# Altium schematic sheet 2_MCU-BLE.SchDoc
size B; SheetNumber: 3; SheetTotal: 13
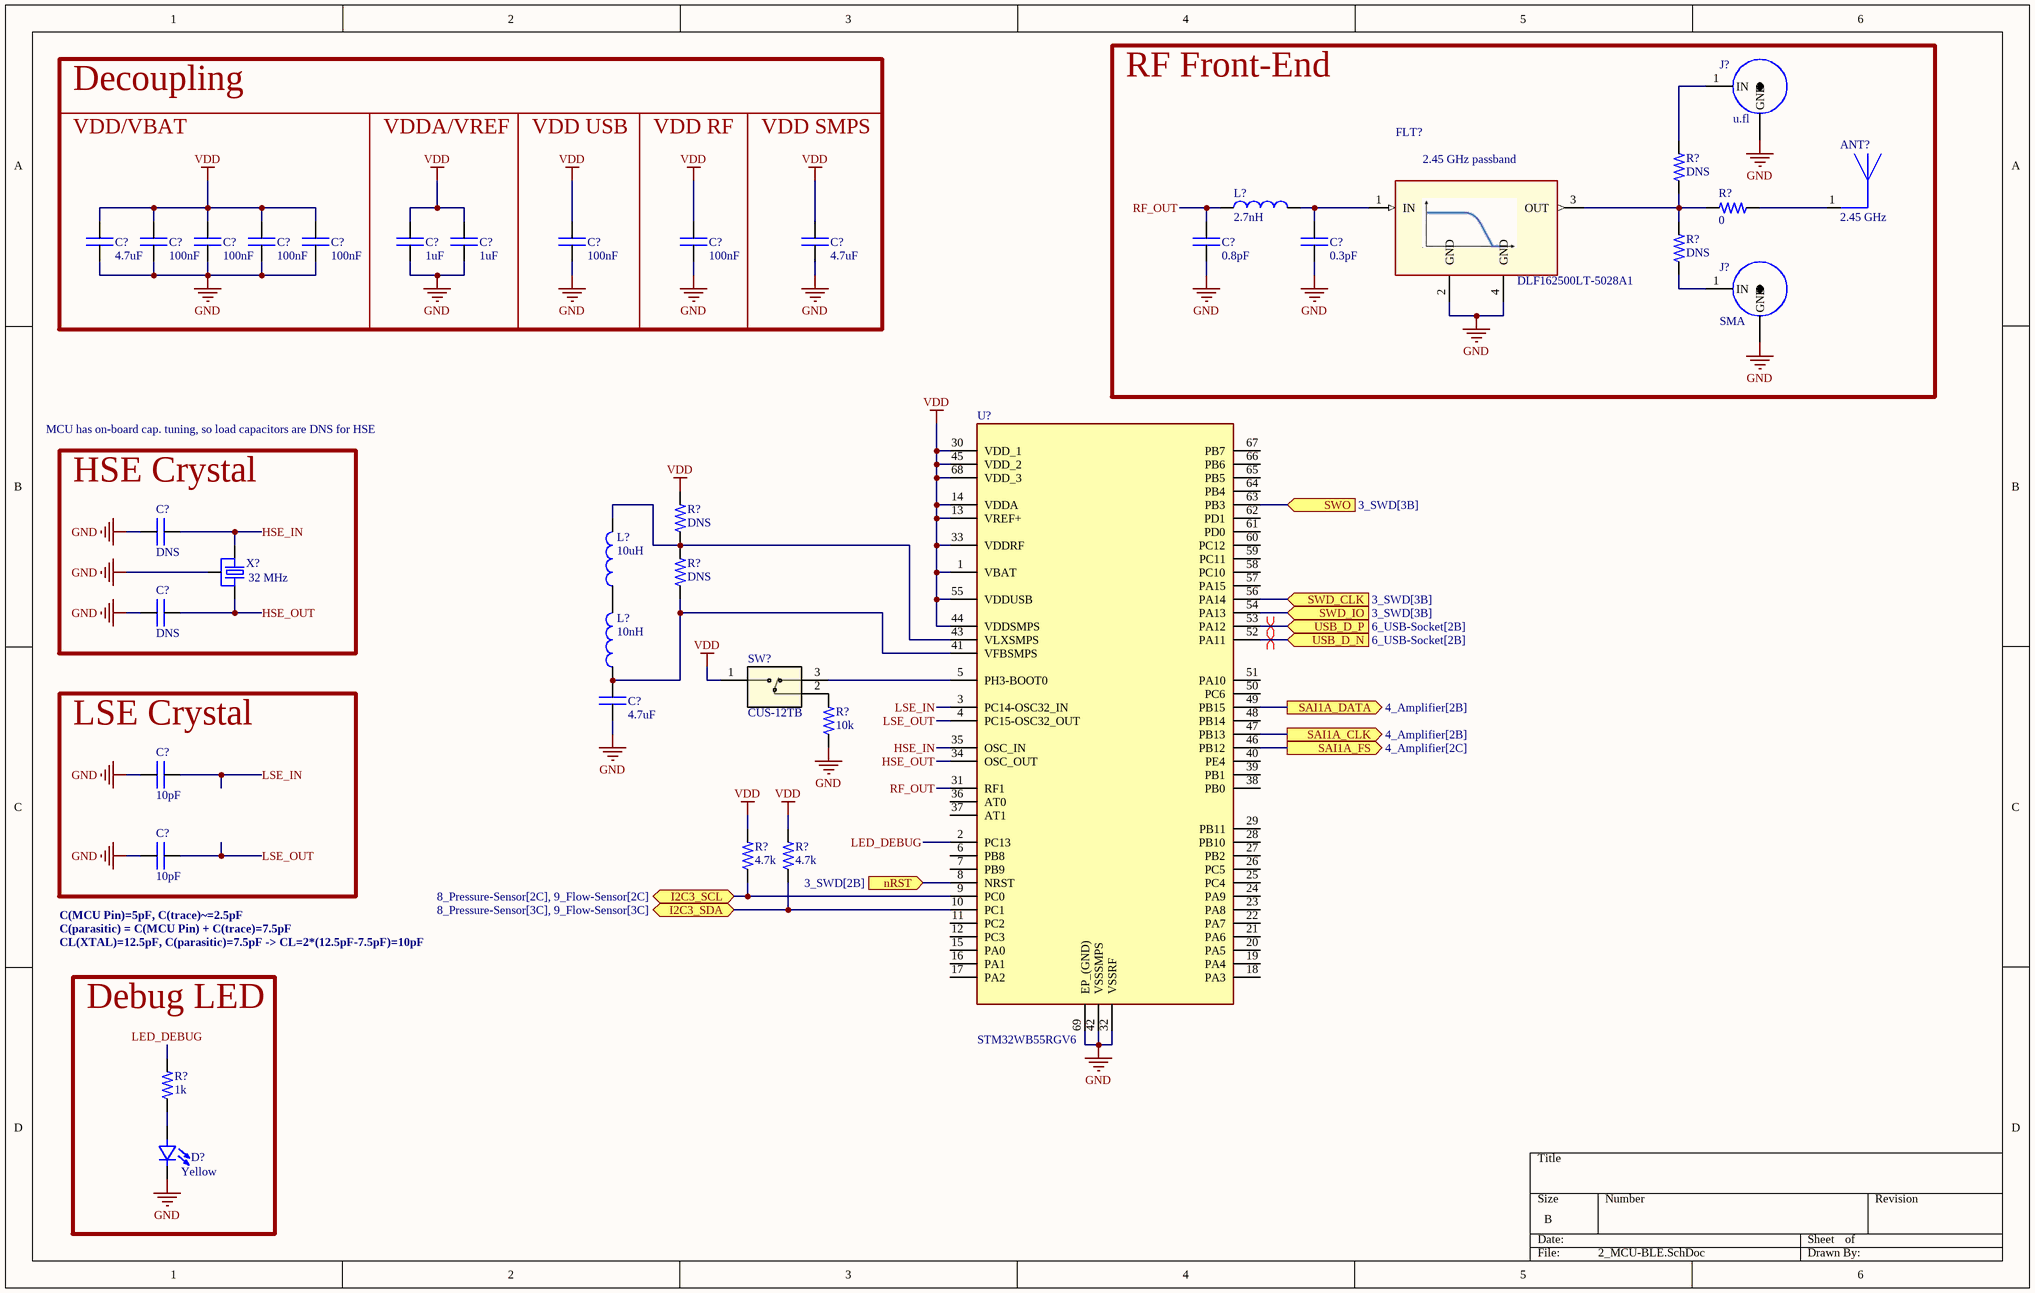
[diagram p0: 2_MCU-BLE.SchDoc]

## Parts
(Parts that share a designator on the sheet are numbered #1, #2 ... from top to bottom, then left to right.)
ANT?  Center Frequency: 2.45 GHz  [ANTC5220X130N]  (hidden comment: CHIP ANTENNA)
C?#1  value 4.7uF  [0402C]  (hidden comment: CAP)
C?#2  value 100nF  [0402C]  (hidden comment: CAP)
C?#3  value 100nF  [0402C]  (hidden comment: CAP)
C?#4  value 100nF  [0402C]  (hidden comment: CAP)
C?#5  value 100nF  [0402C]  (hidden comment: CAP)
C?#6  value 1uF  [0402C]  (hidden comment: CAP)
C?#7  value 1uF  [0402C]  (hidden comment: CAP)
C?#8  value 100nF  [0402C]  (hidden comment: CAP)
C?#9  value 100nF  [0402C]  (hidden comment: CAP)
C?#10  value 4.7uF  [0402C]  (hidden comment: CAP)
C?#11  value 0.8pF  [0402C]  (hidden comment: CAP)
C?#12  value 0.3pF  [0402C]  (hidden comment: CAP)
C?#13  value DNS  [0402C]  (hidden comment: CAP)
C?#14  value DNS  [0402C]  (hidden comment: CAP)
C?#15  value 4.7uF  [0402C]  (hidden comment: CAP)
C?#16  value 10pF  [0402C]  (hidden comment: CAP)
C?#17  value 10pF  [0402C]  (hidden comment: CAP)
D?  Color: Yellow  [0603-LED]  (hidden comment: LED - single)
FLT?  DLF162500LT-5028A1  [DLF-4_1P6X0P8]
J?#1  u.fl  [U.FL]
J?#2  SMA  [SMA TH RA]
L?#1  value 2.7nH  [0806L]  (hidden comment: IND)
L?#2  value 10uH  (hidden comment: IND)
L?#3  value 10nH  (hidden comment: IND)
R?#1  value DNS  [0402R]  (hidden comment: RES)
R?#2  value 0  [0402R]  (hidden comment: RES)
R?#3  value DNS  [0402R]  (hidden comment: RES)
R?#4  value DNS  [0402R]  (hidden comment: RES)
R?#5  value DNS  [0402R]  (hidden comment: RES)
R?#6  value 10k  [0402R]  (hidden comment: RES)
R?#7  value 4.7k  [0402R]  (hidden comment: RES)
R?#8  value 4.7k  [0402R]  (hidden comment: RES)
R?#9  value 1k  [0402R]  (hidden comment: RES)
SW?  CUS-12TB  [CUS-12TB_NDC]
U?  STM32WB55RGV6  [VQFN-68]
X?  Frequency: 32 MHz  [32MHZ_SMD1612-4P]  (hidden comment: XTAL-OSC_32MHz)

## Blocks framed on the sheet
RF Front-End: ANT? C?#11 C?#12 FLT? J?#1 J?#2 L?#1 R?#1-R?#3
Decoupling: C?#1-C?#5
VDDA/VREF: C?#6 C?#7
VDD USB: C?#8
VDD RF: C?#9
VDD SMPS: C?#10
HSE Crystal: C?#13 C?#14 X?
LSE Crystal: C?#16 C?#17
Debug LED: D? R?#9

## Ports
I2C3_SCL (bidir, see 8_Pressure-Sensor[2C], 9_Flow-Sensor[2C]), I2C3_SDA (bidir, see 8_Pressure-Sensor[3C], 9_Flow-Sensor[3C]), nRST (in, see 3_SWD[2B]), SAI1A_CLK (out, see 4_Amplifier[2B]), SAI1A_DATA (out, see 4_Amplifier[2B]), SAI1A_FS (out, see 4_Amplifier[2C]), SWD_CLK (in, see 3_SWD[3B]), SWD_IO (in, see 3_SWD[3B]), SWO (in, see 3_SWD[3B]), USB_D_N (in, see 6_USB-Socket[2B]), USB_D_P (in, see 6_USB-Socket[2B])

## Nets
GND: C?#1.1 C?#2.1 C?#3.1 C?#4.1 C?#5.1 C?#6.1 C?#7.1 C?#8.1 C?#9.1 C?#10.1 C?#11.1 C?#12.1 C?#13.2 C?#14.2 C?#15.1 C?#16.2 C?#17.2 D?.2(C) FLT?.2(GND) FLT?.4(GND) J?#1.GND J?#2.GND R?#6.1 U?.32(VSSRF) U?.42(VSSSMPS) U?.69(EP_(GND)) X?.GND
VDD: C?#1.2 C?#2.2 C?#3.2 C?#4.2 C?#5.2 C?#6.2 C?#7.2 C?#8.2 C?#9.2 C?#10.2 R?#4.2 R?#7.2 R?#8.2 SW?.1 U?.1(VBAT) U?.13(VREF+) U?.14(VDDA) U?.30(VDD_1) U?.33(VDDRF) U?.44(VDDSMPS) U?.45(VDD_2) U?.55(VDDUSB) U?.68(VDD_3)
HSE_IN: C?#13.1 U?.35(OSC_IN) X?.1
HSE_OUT: C?#14.1 U?.34(OSC_OUT) X?.3
I2C3_SCL: R?#7.1 U?.9(PC0) ; port I2C3_SCL
I2C3_SDA: R?#8.1 U?.10(PC1) ; port I2C3_SDA
LED_DEBUG: R?#9.2 U?.2(PC13)
LSE_IN: C?#16.1 U?.3(PC14-OSC32_IN)
LSE_OUT: C?#17.1 U?.4(PC15-OSC32_OUT)
nRST: U?.8(NRST) ; port nRST
RF_OUT: C?#11.2 L?#1.1 U?.31(RF1)
SAI1A_CLK: U?.47(PB13) ; port SAI1A_CLK
SAI1A_DATA: U?.49(PB15) ; port SAI1A_DATA
SAI1A_FS: U?.46(PB12) ; port SAI1A_FS
SWD_CLK: U?.56(PA14) ; port SWD_CLK
SWD_IO: U?.54(PA13) ; port SWD_IO
SWO: U?.63(PB3) ; port SWO
USB_D_N: U?.52(PA11) ; port USB_D_N
USB_D_P: U?.53(PA12) ; port USB_D_P
NetANT?_1: ANT?.1 R?#2.1
NetC?#12_2: C?#12.2 FLT?.1(IN) L?#1.2
NetC?#15_2: C?#15.2 L?#3.1 R?#5.1 U?.41(VFBSMPS)
NetD?_1: D?.1(A) R?#9.1
NetFLT?_3: FLT?.3(OUT) R?#1.1 R?#2.2 R?#3.2
NetJ?#1_1: J?#1.1(IN) R?#1.2
NetJ?#2_1: J?#2.1(IN) R?#3.1
NetL?#2_1: L?#2.1 L?#3.2
NetL?#2_2: L?#2.2 R?#4.1 R?#5.2 U?.43(VLXSMPS)
NetR?#6_2: R?#6.2 SW?.2
NetSW?_3: SW?.3 U?.5(PH3-BOOT0)

Not connected (* = marked no-connect by the designer): U? 6(PB8) 7(PB9) 11(PC2) 12(PC3) 15(PA0) 16(PA1) 17(PA2) 18(PA3) 19(PA4) 20(PA5) 21(PA6) 22(PA7) 23(PA8) 24(PA9) 25(PC4) 26(PC5) 27(PB2) 28(PB10) 29(PB11) 36(AT0) 37(AT1) 38(PB0) 39(PB1) 40(PE4) 48(PB14) 50(PC6) 51(PA10) 57(PA15) 58(PC10) 59(PC11) 60(PC12) 61(PD0) 62(PD1) 64(PB4) 65(PB5) 66(PB6) 67(PB7)

## Layout directives
differential pair: USB_D_N, USB_D_P

## Notes on the sheet
- VDD/VBAT
- MCU has on-board cap. tuning, so load capacitors are DNS for HSE
- CL(XTAL)=12.5pF, C(parasitic)=7.5pF -> CL=2*(12.5pF-7.5pF)=10pF
- C(MCU Pin)=5pF, C(trace)~=2.5pF
- C(parasitic) = C(MCU Pin) + C(trace)=7.5pF
- (in symbol 2.45GHz LPF) 2.45 GHz passband

## Library data of the parts
ANT? = CHIP ANTENNA: MFR: microgate; MFR PN: MGMA5220H2450-A04MGMA5220H2450-A04; Value: MGMA5220H2450-A04; JLCPCB PN: C486321
C?#1-C?#10 C?#13-C?#15 = CAP: Capaicitor; MFR: *; MFR PN: *
C?#11 C?#12 = CAP: Capacitor; MFR: *; MFR PN: *; Footprint: *
  C?#11: JLCPCB PN: C387965
  C?#12: JLCPCB PN: C1855147
C?#16 C?#17 = CAP: Capaicitor; MFR PN: FN15N100J500PNG; MFR: *; JLCPCB PN: C328913
D? = LED - single: LED; Value: 19-213/Y2C-CQ2R2L/3T(CY); MFR: *; MFR PN: *; JLCPCB PN: C72038
FLT? = 2.45GHz LPF: RF FILTER LOW PASS 2.45GHZ 0603; MFR: TDK; MFR PN: DLF162500LT-5028A1; Value: DLF162500LT-5028A1; JLCPCB PN: C531364
J?#1 = u.fl CONN: u.fl 50Ohm; MFR: HRS(Hirose); MFR PN: U.FL-R-SMT-1(80); Value: U.FL-R-SMT-1(80); JLCPCB PN: C88374
J?#2 = SMA: SMA 50Ohm; MFR: DreamLNK; MFR PN: SMA-KWE901; Value: SMA-KWE901; JLCPCB PN: C914553
L?#1-L?#3 = IND: INDUCTOR; Footprint: *
  L?#1: JLCPCB PN: C963981
  L?#2 L?#3: JLCPCB PN: *
R?#1-R?#9 = RES: Resistor; MFR PN: *; MFR: *
  R?#1-R?#3 R?#7 R?#8: JLCPCB PN: *
  R?#4-R?#6 R?#9: Type: SMD
SW? = SPDT SLIDE SWITCH: JLC Alternate: / SSSS811101; MFR: Nidec Copal Electronics; MFR PN: CUS-12TB; Type: SMD
U? = STM32WB55RGV6: ARM Microcontrollers - MCU Ultra-low-power dual core Arm Cortex-M4 MCU 64 MHz, Cortex-M0 32MHz with 1 Mbyte Flash, BLE, 802.15.4, USB, LCD, AES-256; MFR: STMicroelectronics; Value: STM32WB55RGV6; JLCPCB Part #: *
X? = XTAL-OSC_32MHz: SMD Tuning Fork Crystal; MFR PN: Murata; Value: XRCMD32M000FXP50R0; Type: SMD; JLCPCB PN: C341820